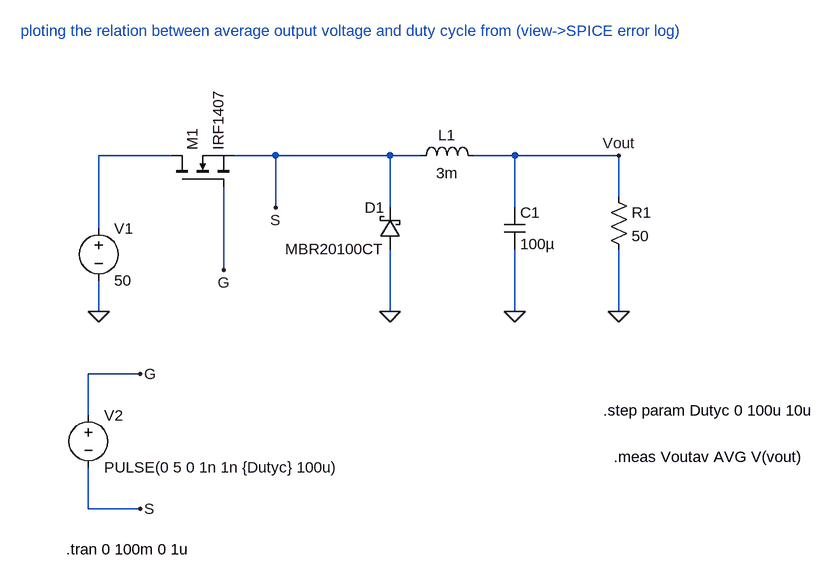
[diagram p0: schematic buck-converter-duty-cycle-relation.asc]
buck-converter-duty-cycle-relation.asc, the LTspice schematic file:
Version 4
SHEET 1 2236 688
WIRE 112 64 0 64
WIRE 272 64 208 64
WIRE 448 64 272 64
WIRE 496 64 448 64
WIRE 640 64 576 64
WIRE 800 64 640 64
WIRE 800 128 800 64
WIRE 272 144 272 64
WIRE 448 144 448 64
WIRE 640 144 640 64
WIRE 0 176 0 64
WIRE 192 240 192 112
WIRE 0 304 0 256
WIRE 448 304 448 208
WIRE 640 304 640 208
WIRE 800 304 800 208
WIRE 64 400 -16 400
WIRE -16 464 -16 400
WIRE -16 608 -16 544
WIRE 64 608 -16 608
FLAG 0 304 0
FLAG 448 304 0
FLAG 640 304 0
FLAG 800 304 0
FLAG 64 400 G
FLAG 64 608 S
FLAG 192 240 G
FLAG 272 144 S
FLAG 800 64 Vout
SYMBOL voltage 0 160 R0
WINDOW 123 0 0 Left 0
WINDOW 39 0 0 Left 0
SYMATTR InstName V1
SYMATTR Value 50
SYMBOL schottky 464 208 R180
WINDOW 0 24 64 Left 2
WINDOW 3 24 0 Left 2
SYMATTR InstName D1
SYMATTR Value MBR20100CT
SYMATTR Description Diode
SYMATTR Type diode
SYMBOL nmos 112 112 R270
SYMATTR InstName M1
SYMATTR Value IRF1407
SYMBOL ind 480 80 R270
WINDOW 0 32 56 VTop 2
WINDOW 3 5 56 VBottom 2
SYMATTR InstName L1
SYMATTR Value 3m
SYMBOL cap 624 144 R0
SYMATTR InstName C1
SYMATTR Value 100µ
SYMBOL res 784 112 R0
SYMATTR InstName R1
SYMATTR Value 50
SYMBOL voltage -16 448 R0
WINDOW 123 0 0 Left 0
WINDOW 39 0 0 Left 0
SYMATTR InstName V2
SYMATTR Value PULSE(0 5 0 1n 1n {Dutyc} 100u)
TEXT -50 670 Left 2 !.tran 0 100m 0 1u
TEXT 776 456 Left 2 !.step param Dutyc 0 100u 10u
TEXT 792 528 Left 2 !.meas Voutav AVG V(vout)
TEXT -120 -128 Left 2 ;ploting the relation between average output voltage and duty cycle from (view->SPICE error log)

The netlist it stands for:
* buck-converter-duty-cycle-relation.asc
V1 N001 0 50
D1 0 S MBR20100CT
M1 N001 G S S IRF1407
L1 S Vout 3m
C1 Vout 0 100µ
R1 Vout 0 50
V2 G S PULSE(0 5 0 1n 1n {Dutyc} 100u)
.model D D
.lib standard.dio
.model NMOS NMOS
.model PMOS PMOS
.lib standard.mos
.tran 0 100m 0 1u
.step param Dutyc 0 100u 10u
.meas Voutav AVG V(vout)
* ploting the relation between average output voltage and duty cycle from (view->SPICE error log)
.backanno
.end